# EAGLE design untitled (EAGLE 9.6.2)
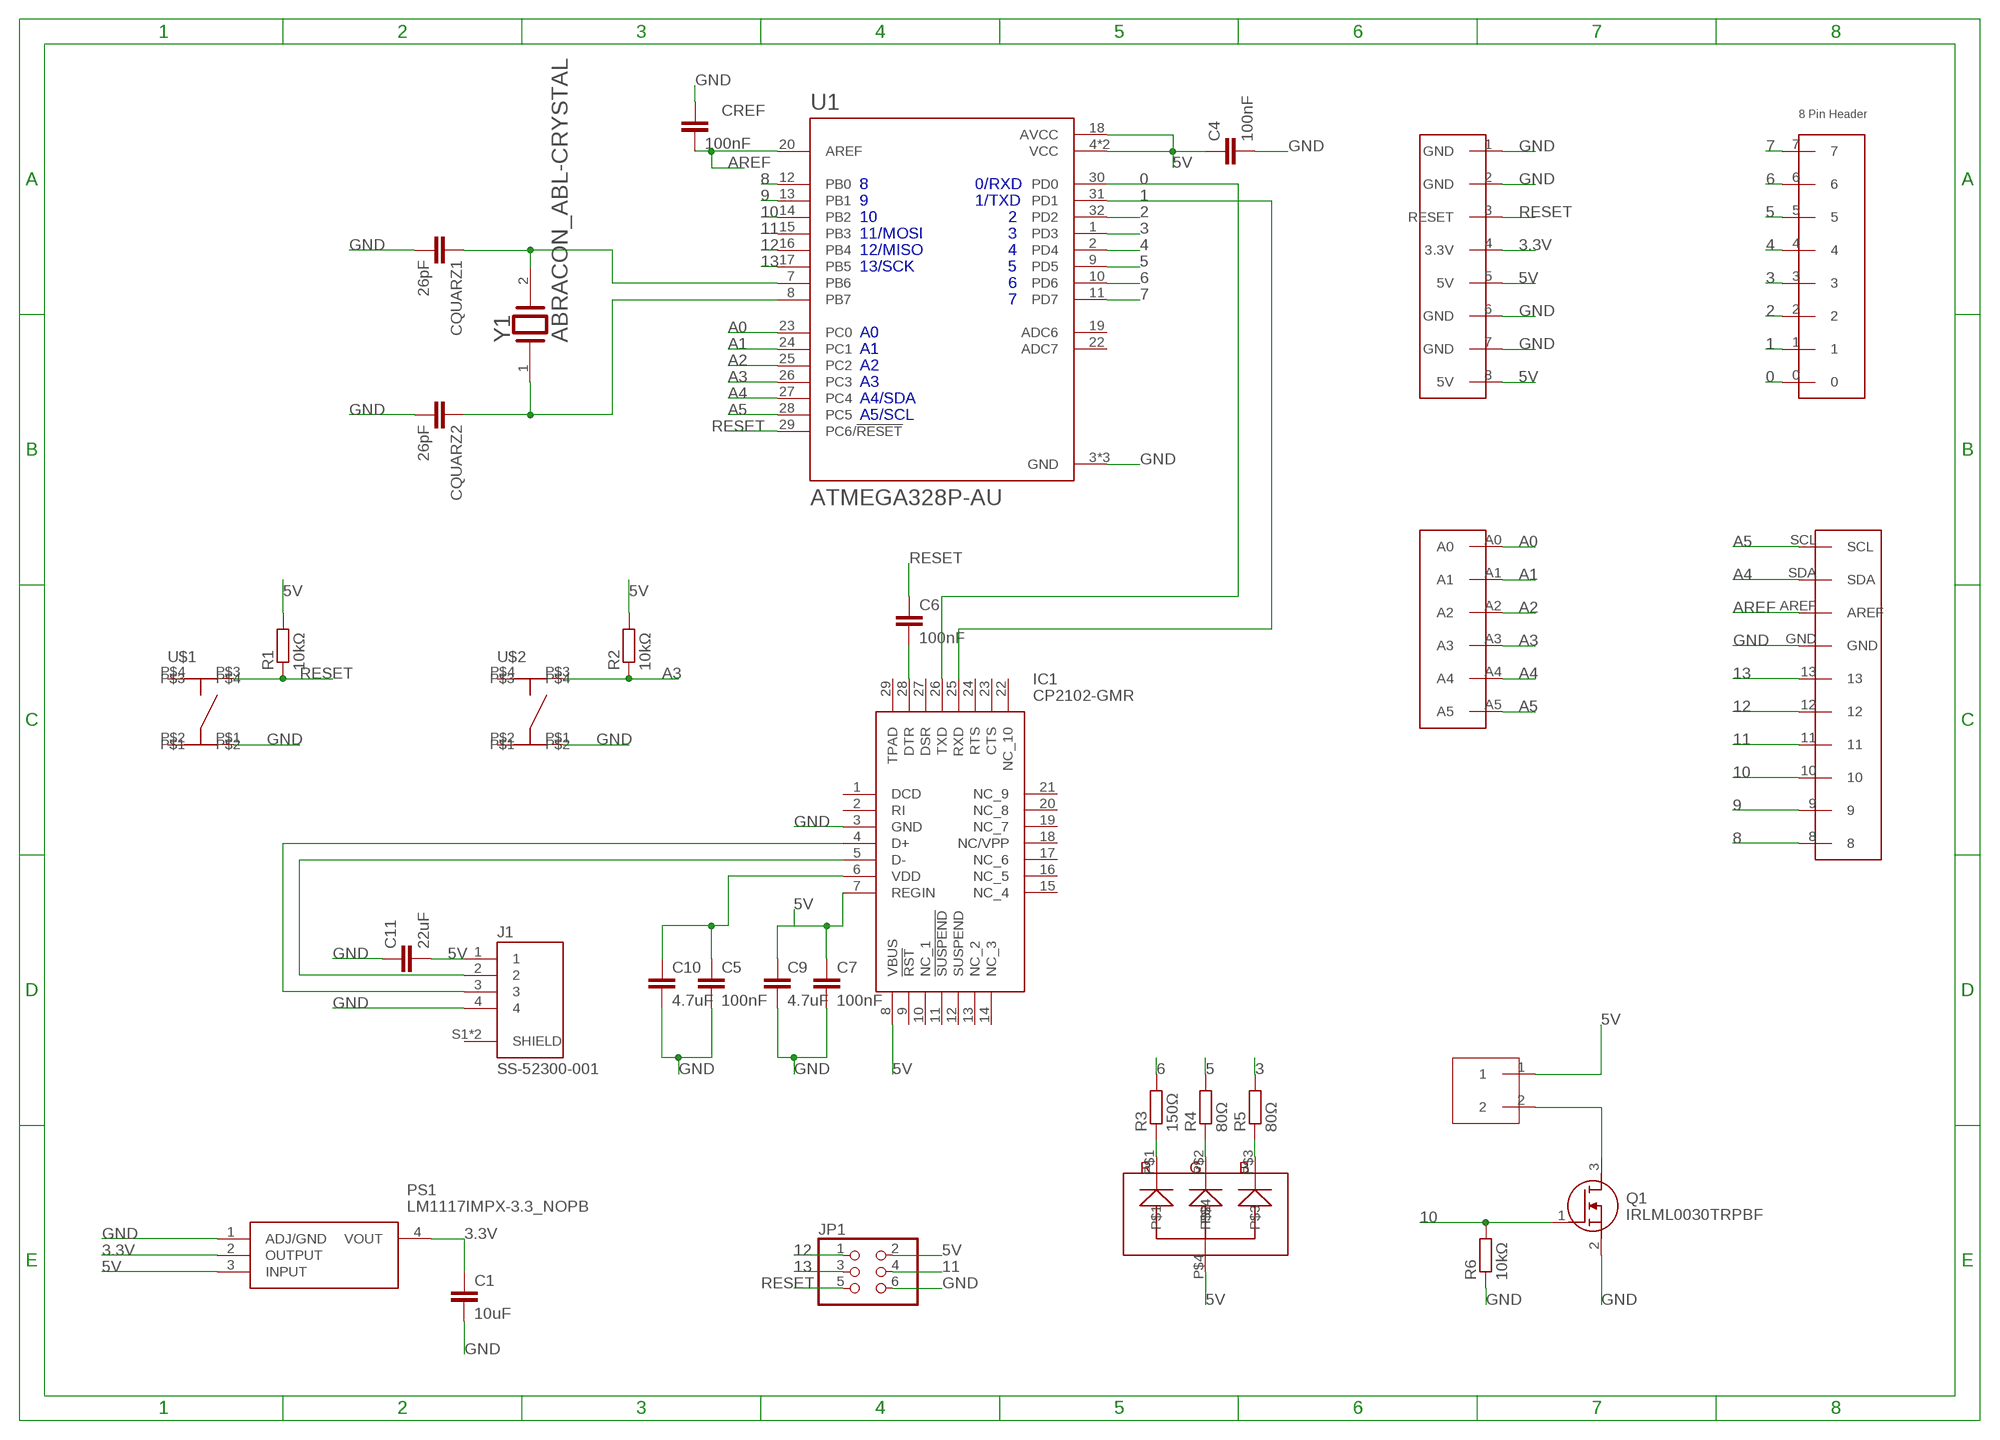
[diagram p0: schematic, sheet 1]

## Parts
C1  10uF  C-EUC1206  [C1206]
C4  100nF  C-EUC1206  [C1206]
C5  100nF  C-EUC1206  [C1206]
C6  100nF  C-EUC1206  [C1206]
C7  100nF  C-EUC1206  [C1206]
C9  4.7uF  C-EUC1206  [C1206]
C10  4.7uF  C-EUC1206  [C1206]
C11  22uF  C-EUC1206  [C1206]
CQUARZ1  26pF  C-EUC1206  [C1206]
CQUARZ2  26pF  C-EUC1206  [C1206]
CREF  100nF  C-EUC1206  [C1206]
IC1  CP2102-GMR  [QFN50P500X500X100-29N]
J1  SS-52300-001  [BEL_SS-52300-001]
JP1  PINHD-2X3  [2X03]
PS1  LM1117IMPX-3.3_NOPB  [SOT230P700X180-4N]
Q1  IRLML0030TRPBF  [SOT95P237X112-3N]
R1  10kΩ  R-EU_R1206  [R1206]
R2  10kΩ  R-EU_R1206  [R1206]
R3  150Ω  R-EU_R1206  [R1206]
R4  80Ω  R-EU_R1206  [R1206]
R5  80Ω  R-EU_R1206  [R1206]
R6  10kΩ  R-EU_R1206  [R1206]
U1  ATMEGA328P-AU  [QFP80P900X900X120-32N]
U$1  TASTER_9315  [TASTER_9315]
U$2  TASTER_9315  [TASTER_9315]
U$3  RGBLED_6723  [RGBLED]
U$4  6_PIN_HEADER_ARDUINO_UNO  [6_PIN_HEADER_ARDUINO_UNO]
U$5  8_PIN_HEADER_ARDUINO_UNO_1  [8_PIN_HEADER_ARDUINO_UNO_1]
U$6  8_PIN_HEADER_ARDUINO_UNO_2  [8_PIN_HEADER_ARDUINO_UNO_2]
U$7  10_PIN_HEADER_ARDUINO_UNO  [10_PIN_HEADER_ARDUINO_UNO]
U$8  JSTPH2PST  [B2B-PH-K-S]
Y1  ABRACON_ABL-CRYSTALABRACON_ABL-16.000MHZ-B2_0_0  [HC-49/US]

## Nets
0: IC1.26(TXD) U1.30(PD0) U$5.0
1: IC1.25(RXD) U1.31(PD1) U$5.1
2: U1.32(PD2) U$5.2
3: R5.2 U1.1(PD3) U$5.3
3.3V: C1.1 PS1.2(OUTPUT) PS1.4(VOUT) U$6.4(3.3V)
4: U1.2(PD4) U$5.4
5: R4.2 U1.9(PD5) U$5.5
5V: C4.1 C7.1 C9.1 C11.2 IC1.7(REGIN) IC1.8(VBUS) J1.1 JP1.2 PS1.3(INPUT) R1.2 R2.2 U1.4(VCC) U1.6(VCC) U1.18(AVCC) U$3.P$4 U$6.5(5V) U$6.8(5V) U$8.1
6: R3.2 U1.10(PD6) U$5.6
7: U1.11(PD7) U$5.7
8: U1.12(PB0) U$7.8
9: U1.13(PB1) U$7.9
10: Q1.1(G) R6.2 U1.14(PB2) U$7.10
11: JP1.4 U1.15(PB3) U$7.11
12: JP1.1 U1.16(PB4) U$7.12
13: JP1.3 U1.17(PB5) U$7.13
A0: U1.23(PC0) U$4.A0
A1: U1.24(PC1) U$4.A1
A2: U1.25(PC2) U$4.A2
A3: R2.1 U1.26(PC3) U$2.P$3 U$4.A3
A4: U1.27(PC4) U$4.A4 U$7.SDA
A5: U1.28(PC5) U$4.A5 U$7.SCL
AREF: CREF.2 U1.20(AREF) U$7.AREF
GND: C1.2 C4.2 C5.2 C7.2 C9.2 C10.2 C11.1 CQUARZ1.2 CQUARZ2.2 CREF.1 IC1.3(GND) J1.4 JP1.6 PS1.1(ADJ/GND) Q1.2(S) R6.1 U1.3(GND) U1.5(GND) U1.21(GND) U$1.P$1 U$2.P$1 U$6.1(GND) U$6.2(GND) U$6.6(GND) U$6.7(GND) U$7.GND
N$1: Q1.3(D) U$8.2
N$2: CQUARZ2.1 U1.8(PB7) Y1.1
N$3: CQUARZ1.1 U1.7(PB6) Y1.2
N$4: IC1.5(D-) J1.2
N$5: IC1.4(D+) J1.3
N$6: C5.1 C10.1 IC1.6(VDD)
N$7: C6.2 IC1.28(DTR)
N$8: R3.1 U$3.P$1
N$9: R4.1 U$3.P$2
N$10: R5.1 U$3.P$3
RESET: C6.1 JP1.5 R1.1 U1.29(PC6/!RESET) U$1.P$3 U$6.3(RESET)
Unconnected: IC1.1(DCD) IC1.2(RI) IC1.9(!RST) IC1.10(NC_1) IC1.11(!SUSPEND) IC1.12(SUSPEND) IC1.13(NC_2) IC1.14(NC_3) IC1.15(NC_4) IC1.16(NC_5) IC1.17(NC_6) IC1.18(NC/VPP) IC1.19(NC_7) IC1.20(NC_8) IC1.21(NC_9) IC1.22(NC_10) IC1.23(CTS) IC1.24(RTS) IC1.27(DSR) IC1.29(TPAD) J1.S1(SHIELD) J1.S2(SHIELD) U1.19(ADC6) U1.22(ADC7) U$1.P$2 U$1.P$4 U$2.P$2 U$2.P$4

## Library data of the parts
C1 C4-C7 C9-C11 CQUARZ1 CQUARZ2 CREF = rcl:C-EU: CAPACITOR, European symbol; SPICEPREFIX: C
IC1 = CP2102-GMR:CP2102-GMR: I/O Controller Interface IC USB-TO-UART BRIDGE, qfn-28 Source: Datasheet <https://www.silabs.com/Support Documents/TechnicalDocs/CP2102-9.pdf>; DESCRIPTION: I/O Controller Interface IC USB-TO-UART BRIDGE, qfn-28; HEIGHT: 1mm; MANUFACTURER_NAME: Silicon Labs; MANUFACTURER_PART_NUMBER: CP2102-GMR; MOUSER_PART_NUMBER: 634-CP2102-GMR; MOUSER_PRICE-STOCK: https://www.mouser.co.uk/ProductDetail/Silicon-Labs/CP2102-GMR?qs=cNyzPCcHMUWu%2FiPhR8KQAw%3D%3D
J1 = SS-52300-001:SS-52300-001: USB 2.0 - B Connector | 1 Port | Right Angle Receptacle | Shielded Check prices <https://pricing.snapeda.com/parts/SS-52300-001/Stewart%20Connector/view-part?ref=eda>; AVAILABILITY: Warning; DESCRIPTION: USB-B (USB TYPE-B) USB 2.0 Receptacle Connector 4 Position Through Hole; MF: Stewart Connector; MP: SS-52300-001; PACKAGE: None; PRICE: None; PURCHASE-URL: https://pricing.snapeda.com/search/part/SS-52300-001/?ref=eda
JP1 = pinhead:PINHD-2X3: PIN HEADER
PS1 = LM1117IMPX-3.3_NOPB:LM1117IMPX-3.3_NOPB: Space saving 800-mA low-dropout linear regulator with internal current limit Source: Datasheet <http://www.ti.com/lit/gpn/LM1117>; DESCRIPTION: Space saving 800-mA low-dropout linear regulator with internal current limit; HEIGHT: 1.8mm; MANUFACTURER_NAME: Texas Instruments; MANUFACTURER_PART_NUMBER: LM1117IMPX-3.3/NOPB; MOUSER_PART_NUMBER: 926-LM1117IMPX33NOPB; MOUSER_PRICE-STOCK: https://www.mouser.co.uk/ProductDetail/Texas-Instruments/LM1117IMPX-33-NOPB?qs=X1J7HmVL2ZG7K12CpArCeA%3D%3D
Q1 = IRLML0030TRPBF:IRLML0030TRPBF: INTERNATIONAL RECTIFIER - IRLML0030TRPBF - MOSFET, N CH, 30V, 5.3A, SOT23-3 Source: Datasheet <https://componentsearchengine.com/Datasheets/2/IRLML0030TRPBF.pdf> Check prices <https://pricing.snapeda.com/parts/IRLML0030TRPBF/Infineon%20Technologies/view-part?ref=eda>; AVAILABILITY: Good; DESCRIPTION: RoHS Compliant | Low RDS(on) | Industry-Standard Pinout | Compatible with Existing Surface Mount Techniques | Qualified Industrial | Qualified MSL1 | SOT-23 Footprint; MF: Infineon Technologies; MP: IRLML0030TRPBF; PACKAGE: SOT-23-3 Infineon; PRICE: None; PURCHASE-URL: https://pricing.snapeda.com/search/part/IRLML0030TRPBF/?ref=eda
R1-R6 = rcl:R-EU_: RESISTOR, European symbol; SPICEPREFIX: R
U1 = ATMEGA328P-AU:ATMEGA328P-AU: ATmega Series 20 MHz 32 KB Flash 2 KB SRAM 8-Bit Microcontroller - TQFP-32 Check prices <https://pricing.snapeda.com/parts/ATMEGA328P-AU/Microchip%20Technology/view-part?ref=eda>; AVAILABILITY: Good; DESCRIPTION: AVR AVR® ATmega Microcontroller IC 8-Bit 20MHz 32KB (16K x 16) FLASH 32-TQFP (7x7); MF: Microchip Technology; MP: ATMEGA328P-AU; PACKAGE: TQFP-32 Microchip; PRICE: None; PURCHASE-URL: https://pricing.snapeda.com/search/part/ATMEGA328P-AU/?ref=eda
U$1 U$2 = Taster_9315:TASTER_9315
U$3 = rgbled_6723:RGBLED_6723
U$4 = 6_PIN_HEADER_ARDUINO_UNO:6_PIN_HEADER_ARDUINO_UNO
U$5 = 8_PIN_HEADER_ARDUINO_UNO_1:8_PIN_HEADER_ARDUINO_UNO_1
U$6 = 8_PIN_HEADER_ARDUINO_UNO_2:8_PIN_HEADER_ARDUINO_UNO_2
U$7 = 10_PIN_HEADER_ARDUINO_UNO:10_PIN_HEADER_ARDUINO_UNO
U$8 = JST_PH2P_ST:JSTPH2PST
Y1 = Abracon_ABL_CRYSTAL:ABRACON_ABL-CRYSTAL: HC/49US (AT49) MICROPROCESSOR CRYSTAL; CENTROID_NOT_SPECIFIED: No; DATASHEET: http://www.abracon.com/Resonators/ABL.pdf; DIGIKEY_DESCRIPTION: CRYS 16MHz ±20ppm Crystal 18pF 40 Ohm -20°C ~ 70°C Through Hole HC49/US; DIGIKEY_PART_NUMBER: 535-9041-ND; ESR: 40 Ohm; FREQUENCY: 16MHz; FREQUENCY_STABILITY: ±50ppm; FREQUENCY_TOLERANCE: ±20ppm; LEAD_FREE: yes; LOAD_CAPACITANCE: 18pF; MF: Abracon; MOUSER_PART_NUMBER: 815-ABL-16-B2; MPN: ABL-16.000MHZ-B2; OPERATING_MODE: Fundamental; PACKAGE: HC/49US; PREFIX: Y; ROHS: yes; TEMPERATURE_RANGE_HIGH: +70°C; TEMPERATURE_RANGE_LOW: 0°C

## Board
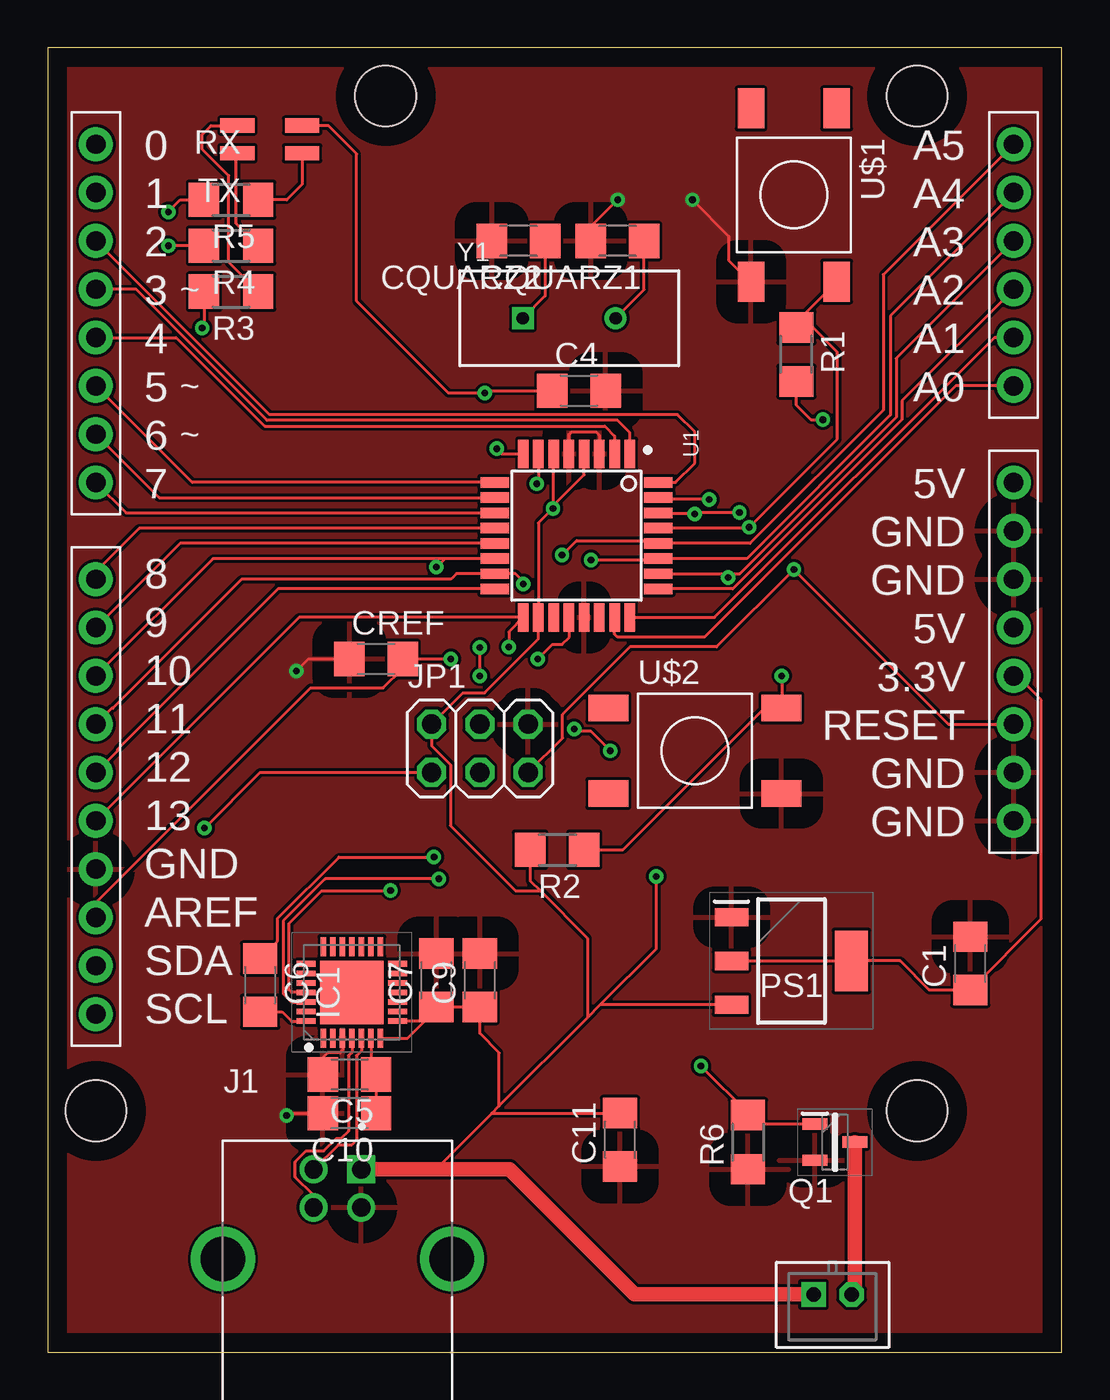
[diagram p1: board, top side]
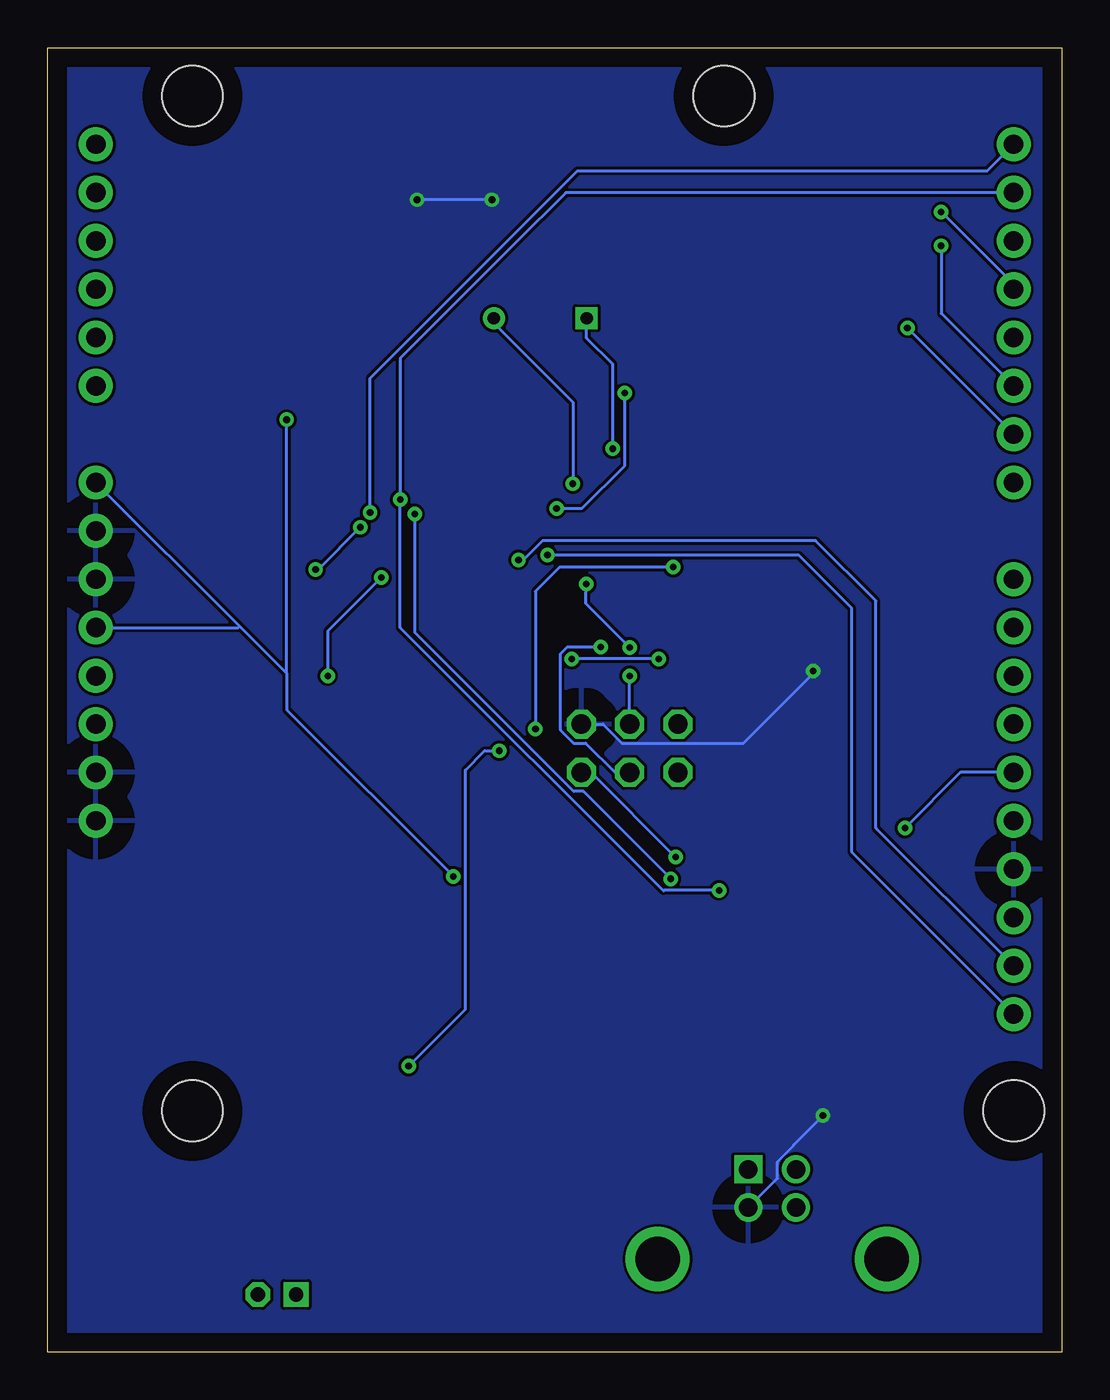
[diagram p2: board, bottom side, seen from below]

Size 53.34 x 68.58 mm. Coordinates in mm from the lower left corner, seen from the top.
Outline: 0,0 53.34,0 53.34,68.58 0,68.58 0,0
Copper layers (1*16): Top 0.035mm / dielectric 1.5mm / Bottom 0.035mm
Design rules "default *": minimum track width 6mil, minimum drill 0.35mm, track to track 6mil, track to pad 6mil, pad to pad 6mil, via to via 6mil, smd to smd 6mil, copper to edge 40mil, drill to drill 6mil, minimum pad ring 10mil, minimum via ring 8mil, stop-mask expansion 4mil, vias tented up to drill 0mil, thermal gap 45mil
Holes 3.2 mm at 17.78,66.04 2.54,12.7 45.72,66.04 45.72,12.7

### Footprints (pad centres in the part's own frame; a part is rotated, then mirrored left to right if it is on the bottom)
C1206 = smd 1.6 x 1.8: 1 -1.4,0; 2 1.4,0
QFN50P500X500X100-29N = smd 1 x 0.3: 1 -2.4,1.5; 2 -2.4,1; 3 -2.4,0.5; 4 -2.4,0; 5 -2.4,-0.5; 6 -2.4,-1; 7 -2.4,-1.5; 15 2.4,-1.5; 16 2.4,-1; 17 2.4,-0.5; 18 2.4,0; 19 2.4,0.5; 20 2.4,1; 21 2.4,1.5 | smd 0.3 x 1: 8 -1.5,-2.4; 9 -1,-2.4; 10 -0.5,-2.4; 11 0,-2.4; 12 0.5,-2.4; 13 1,-2.4; 14 1.5,-2.4; 22 1.5,2.4; 23 1,2.4; 24 0.5,2.4; 25 0,2.4; 26 -0.5,2.4; 27 -1,2.4; 28 -1.5,2.4 | smd 3.35 x 3.35: 29 0,0
BEL_SS-52300-001 = drill 0.97 square: 1 1.25,2 | drill 0.97: 2 -1.25,2; 3 -1.25,0; 4 1.25,0 | drill 2.35: S1 -6.02,-2.71; S2 6.02,-2.71
2X03 = drill 1.016 octagon: 1 -2.54,-1.27; 2 -2.54,1.27; 3 0,-1.27; 4 0,1.27; 5 2.54,-1.27; 6 2.54,1.27
SOT230P700X180-4N = smd 1.75 x 0.95: 1 -3.15,2.3; 2 -3.15,0; 3 -3.15,-2.3 | smd 1.75 x 3.2: 4 3.15,0
SOT95P237X112-3N = smd 1.3 x 0.6: 1 -1.05,0.95; 2 -1.05,-0.95; 3 1.05,0
R1206 = smd 1.6 x 1.803: 1 -1.422,0; 2 1.422,0
QFP80P900X900X120-32N = smd 1.5 x 0.55: 1 -4.3,2.8; 2 -4.3,2; 3 -4.3,1.2; 4 -4.3,0.4; 5 -4.3,-0.4; 6 -4.3,-1.2; 7 -4.3,-2; 8 -4.3,-2.8; 17 4.3,-2.8; 18 4.3,-2; 19 4.3,-1.2; 20 4.3,-0.4; 21 4.3,0.4; 22 4.3,1.2; 23 4.3,2; 24 4.3,2.8 | smd 0.55 x 1.5: 9 -2.8,-4.3; 10 -2,-4.3; 11 -1.2,-4.3; 12 -0.4,-4.3; 13 0.4,-4.3; 14 1.2,-4.3; 15 2,-4.3; 16 2.8,-4.3; 25 2.8,4.3; 26 2,4.3; 27 1.2,4.3; 28 0.4,4.3; 29 -0.4,4.3; 30 -1.2,4.3; 31 -2,4.3; 32 -2.8,4.3
TASTER_9315 = smd 2.1 x 1.4: P$1 4.55,-2.25; P$2 -4.55,-2.25; P$3 4.55,2.25; P$4 -4.55,2.25
RGBLED = smd 1.8 x 0.75: P$1 1.7,-0.725; P$2 1.7,0.725; P$3 -1.7,0.725; P$4 -1.7,-0.725
6_PIN_HEADER_ARDUINO_UNO = drill 1.016 pad 1.778: A0 0,6.35; A1 0,3.81; A2 0,1.27; A3 0,-1.27; A4 0,-3.81; A5 0,-6.35
8_PIN_HEADER_ARDUINO_UNO_1 = drill 1.016 pad 1.778: 0 0,-8.89; 1 0,-6.35; 2 0,-3.81; 3 0,-1.27; 4 0,1.27; 5 0,3.81; 6 0,6.35; 7 0,8.89
8_PIN_HEADER_ARDUINO_UNO_2 = drill 1.016 pad 1.778: 1 0,8.89; 2 0,6.35; 3 0,3.81; 4 0,1.27; 5 0,-1.27; 6 0,-3.81; 7 0,-6.35; 8 0,-8.89
10_PIN_HEADER_ARDUINO_UNO = drill 1.016 pad 1.778: 8 0,11.43; 9 0,8.89; 10 0,6.35; 11 0,3.81; 12 0,1.27; 13 0,-1.27; AREF 0,-6.35; GND 0,-3.81; SCL 0,-11.43; SDA 0,-8.89
B2B-PH-K-S = drill 0.75 pad 1.3 square: 1 1,0 | drill 0.75 pad 1.3 octagon: 2 -1,0
HC-49/US = drill 0.65 pad 1.15 square: 1 -2.44,0 | drill 0.65 pad 1.15: 2 2.44,0

### Placement (x,y rotation side)
C1  48.51,20.45 90 top
C4  27.94,50.55 0 top
C5  15.88,14.61 180 top
C6  11.18,19.3 270 top
C7  20.45,19.56 90 top
C9  22.73,19.56 90 top
C10  15.88,12.57 180 top
C11  30.1,11.18 90 top
CQUARZ1  29.97,58.42 180 top
CQUARZ2  24.77,58.42 180 top
CREF  17.27,36.45 0 top
IC1  16,18.92 90 top
J1  15.24,7.62 0 top
JP1  22.73,31.75 0 top
PS1  39.12,20.57 0 top
Q1  41.4,11.05 0 top
R1  39.37,52.45 270 top
R2  26.8,26.42 180 top
R3  9.65,55.75 180 top
R4  9.65,58.17 180 top
R5  9.65,60.58 180 top
R6  36.83,11.05 90 top
U1  27.81,42.93 270 top
U$1  39.24,60.83 270 top
U$2  34.04,31.62 0 top
U$3  11.68,63.75 180 top
U$4  50.8,57.15 180 top
U$5  2.54,54.61 180 top
U$6  50.8,36.83 180 top
U$7  2.54,29.21 0 top
U$8  41.27,3.05 180 top
Y1  27.43,54.36 0 top

### Tracks (layer width: path | path; a pad name or v marks a point on that pad's centre or on a via)
0  (via drill 0.35)
  Top 0.152: v20.57,24.89 14.61,24.89 12.39,22.68 12.39,18.85 12.83,18.41 IC1.26 | U1.30 32.17,44.07 v34.04,44.07 34.11,44.14 v36.38,44.14
  Bottom 0.152: v20.57,24.89 25.17,29.49 25.68,29.49 34.04,37.84 v34.04,44.07 | U$5.0 3.94,62.1 25.48,62.1 36.38,51.21 v36.38,44.14
1  (via drill 0.35)
  Top 0.152: v34.8,44.83 32.21,44.83 U1.31 | IC1.25 12.83,18.92 12.7,19.05 12.7,22.55 14.4,24.26 18.01,24.26 v18.03,24.29
  Bottom 0.152: U$5.1 26.09,60.96 28.79,58.26 34.8,52.25 v34.8,44.83 34.8,38.1 20.95,24.26 20.93,24.29 v18.03,24.29
2
  Top 0.152: U1.32 33.03,45.73 34.04,46.74 34.04,48.39 33.13,49.29 11.67,49.29 U$5.2
3  (via drill 0.35)
  Top 0.152: U1.1 30.61,48.34 29.97,48.99 11.54,48.99 4.65,55.88 U$5.3 | v6.35,59.94 6.99,60.58 R5.2
  Bottom 0.152: v6.35,59.94 2.54,56.13 U$5.3
3.3V
  Top 0.152: PS1.2 PS1.4 44.83,20.57 46.36,19.05 C1.1 52.25,22.78 52.25,34.29 50.98,35.56 U$6.4
4
  Top 0.152: U$5.4 6.76,53.34 11.42,48.68 29.3,48.68 29.81,48.16 U1.2
5  (via drill 0.35)
  Top 0.152: U1.9 7.61,45.73 U$5.5 | R4.2 v6.35,58.17
  Bottom 0.152: v6.35,58.17 6.35,54.61 U$5.5
5V  (via drill 0.35)
  Top 0.152: C7.1 20.51,18.1 18.94,16.52 IC1.7 | J1.1 20.41,9.62 23.37,12.58 | v32,25.02 32,21.21 29.08,18.29 | 23.37,12.58 23.75,12.95 | 23.75,12.95 28.38,17.59 | 28.38,17.59 29.08,18.29 | 23.75,12.95 23.75,15.75 22.73,16.76 C9.1 C7.1 | R1.2 39.37,49.78 40.13,49.02 v40.77,49.02 | 23.37,12.58 C11.2 | R2.2 25.38,24.79 25.91,24.26 | 28.38,17.59 28.38,21.78 25.91,24.26 | PS1.3 29.1,18.27 29.08,18.29 | 25.91,24.26 24.61,24.26 21.18,27.69 21.18,30.89 20.19,31.88 JP1.2 21.84,34.67 22.99,34.67 25.81,37.5 U1.18 25.81,43.59 v26.57,44.35 26.61,44.39 26.61,44.52 | U1.4 28.21,46.12 26.61,44.52 | C4.1 23.11,50.55 v22.99,50.42 21.08,50.42 16.26,55.24 16.26,62.99 14.77,64.48 U$3.P$4 | 26.61,44.52 U1.6 | IC1.8 19.71,17.42 C7.1
  Top 0.762: U$8.1 30.86,3.05 24.29,9.62 J1.1
  Bottom 0.152: v32,25.02 40.77,33.78 40.77,35.69 | 40.77,35.69 v40.77,49.02 | U$6.5 43.31,38.1 43.24,38.16 | U$6.8 43.24,38.16 | 43.24,38.16 40.77,35.69 | v26.57,44.35 25.24,44.35 22.99,46.61 v22.99,50.42
6  (via drill 0.35)
  Top 0.152: U$5.6 5.87,44.93 U1.10 | R3.2 8.23,54 8.26,53.98 v8.13,53.85
  Bottom 0.152: v8.13,53.85 U$5.6
7
  Top 0.152: U$5.7 4.13,44.13 U1.11
8
  Top 0.152: U1.12 23.49,43.31 4.83,43.31 2.54,41.02 U$7.8
9
  Top 0.152: U1.13 6.97,42.53 U$7.9
10  (via drill 0.35)
  Top 0.152: U1.14 20.9,41.73 | 20.9,41.73 8.71,41.73 U$7.10 | v29.59,31.62 28.57,32.64 27.69,32.64 v27.69,32.77 | v34.35,15.05 36.84,12.56 36.84,12.46 R6.2 37.3,12 Q1.1 | v20.45,41.27 20.9,41.73
  Bottom 0.152: v34.35,15.05 31.37,18.03 31.37,30.61 30.35,31.62 v29.59,31.62 | v20.45,41.27 26.42,41.27 27.69,40.01 v27.69,32.77
11  (via drill 0.35)
  Top 0.152: U$7.11 3.37,33.85 3.43,33.85 10.22,40.64 21.21,40.64 21.5,40.93 U1.15 24.61,40.93 25.02,40.51 v25.02,40.39 | v22.73,35.56 v22.73,37.06
  Bottom 0.152: JP1.4 v22.73,35.56 | v22.73,37.06 25.02,39.34 v25.02,40.39
12  (via drill 0.35)
  Top 0.152: U1.16 12.12,40.13 3.68,31.69 3.68,31.62 U$7.12 | v8.26,27.56 11.18,30.48 JP1.1
  Bottom 0.152: U$7.12 5.33,30.48 v8.26,27.56
13  (via drill 0.35)
  Top 0.152: U$7.13 13.23,38.63 U1.17 24.26,37.87 v24.26,37.08
  Bottom 0.152: JP1.3 23.5,30.48 25.04,32.03 25.68,32.03 26.39,32.73 26.39,36.7 26.03,37.06 24.29,37.06 v24.26,37.08
A0
  Top 0.152: U$4.A0 47.75,50.8 34.54,37.59 29.97,37.59 29.81,37.75 U1.23
A1
  Top 0.152: U$4.A1 49.78,53.34 35.07,38.63 U1.24
A2
  Top 0.152: U$4.A2 44.93,50.01 44.93,49.02 36.03,40.13 U1.25
A3  (via drill 0.35)
  Top 0.152: U$4.A3 44.63,52.25 44.63,49.15 36.4,40.93 35.69,40.93 | R2.1 30.25,26.42 37.71,33.87 U$2.P$3 38.61,33.9 v38.61,35.56 | U1.26 35.69,40.93 | v35.78,40.73 35.78,40.66 35.69,40.75 35.69,40.93
  Bottom 0.152: v35.78,40.73 38.61,37.91 v38.61,35.56
A4  (via drill 0.35)
  Top 0.152: U$4.A4 44.32,54.48 44.32,49.28 36.77,41.73 U1.27 32.04,41.66 v28.57,41.66
  Bottom 0.152: U$7.SDA 9.78,27.56 9.78,39.5 12.95,42.67 27.3,42.67 28.32,41.66 v28.57,41.66
A5  (via drill 0.35)
  Top 0.152: U$4.A5 43.94,56.64 43.94,49.53 36.94,42.53 U1.28 31.97,42.67 27.81,42.67 v27.05,41.91
  Bottom 0.152: U$7.SCL 11.05,26.29 11.05,39.12 13.84,41.91 v27.05,41.91
AREF  (via drill 0.35)
  Top 0.152: U1.20 27.43,38.61 27.43,37.59 27.05,37.21 26.54,37.21 v25.78,36.45 | U$7.AREF 2.54,23.62 13.84,34.92 17.65,34.92 18.67,35.94 CREF.2 v21.21,36.45
  Bottom 0.152: v21.21,36.45 v25.78,36.45
GND  (via drill 0.35)
  Top 0.152: IC1.3 15.5,15.88 15.37,15.75 14.73,15.75 14.47,15.49 C5.2 | CQUARZ1.2 28.57,59.18 v29.97,60.58 | v33.91,60.58 35.81,58.67 35.81,57.4 36.94,56.28 U$1.P$1 | v13.08,35.81 13.72,36.45 CREF.1 | U1.5 27.41,48.24 27.55,48.38 28.84,48.38 29.01,48.2 U1.3 | v12.57,12.45 12.7,12.57 C10.2
  Bottom 0.152: v29.97,60.58 v33.91,60.58 | JP1.6 24.13,33.02 23.14,32.03 16.74,32.03 13.08,35.69 v13.08,35.81 | J1.4 14.96,9.15 14.96,10.02 14.1,10.88 14.1,10.92 12.7,12.32 12.57,12.32 v12.57,12.45
  pour Top: -1.52,69.85 -1.52,-2.03 54.61,-2.03 54.61,69.85
  pour Bottom: -2.54,-2.29 -2.54,70.48 57.28,70.48 57.28,-2.29
N$1
  Top 0.762: Q1.3 42.45,3.23 U$8.2
N$2  (via drill 0.35)
  Top 0.152: CQUARZ2.1 26.16,55.53 Y1.1 | v23.62,47.5 23.89,47.23 U1.8
  Bottom 0.152: v23.62,47.5 23.62,51.94 24.99,53.31 Y1.1
N$3  (via drill 0.35)
  Top 0.152: Y1.2 31.37,55.86 CQUARZ1.1 | U1.7 25.81,45.62 25.78,45.59 v25.72,45.66
  Bottom 0.152: v25.72,45.66 25.72,49.95 29.87,54.1 Y1.2
N$4
  Top 0.152: J1.2 15.29,10.92 16,10.92 16.25,11.17 16.25,15.6 16.5,15.86 IC1.5
N$5
  Top 0.152: J1.3 13.99,8.25 13.02,9.22 13.02,10.02 13.59,10.59 14.53,10.59 15.17,11.23 15.42,11.23 15.82,11.63 15.82,15.61 16,15.79 IC1.4
N$6
  Top 0.152: IC1.6 17,14.88 C5.1 C10.1
N$7
  Top 0.152: C6.2 12.32,17.9 12.83,17.4 13.58,17.4 IC1.28
N$8
  Top 0.152: R3.1 9.53,57.3 9.53,61.85 8.13,63.25 8.13,64.01 8.6,64.48 U$3.P$1
N$9
  Top 0.152: R4.1 9.98,59.26 9.92,59.32 9.92,62.96 U$3.P$2
N$10
  Top 0.152: U$3.P$3 13.38,61.39 12.57,60.58 R5.1
RESET  (via drill 0.35)
  Top 0.152: U$6.3 47.37,33.02 v39.24,41.15 35.18,37.08 30.62,37.08 27.08,33.54 27.08,32.29 JP1.5 | 39.5,53.87 40.23,53.87 41.53,52.58 41.53,48.01 v36.89,43.37 36.85,43.33 U1.29 | 39.5,53.87 R1.1 | U$1.P$3 39.5,54.29 39.5,53.87 | C6.1 12.09,21.62 12.09,22.81 15.32,26.04 v20.32,26.04
  Bottom 0.152: v36.89,43.37 39.12,41.15 v39.24,41.15 | v20.32,26.04 24.77,30.48 JP1.5